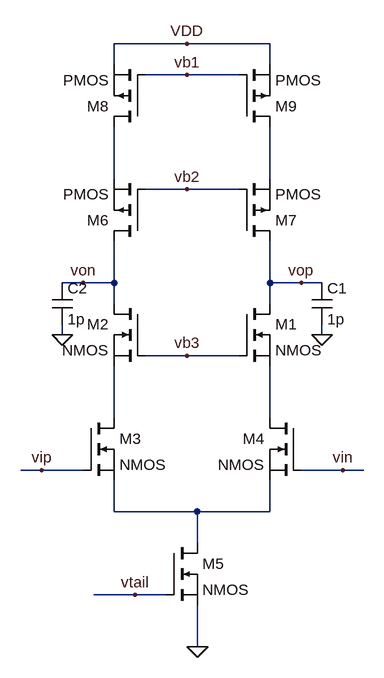
[diagram p0: schematic fully_differential_tele_casc.asc]
fully_differential_tele_casc.asc, the LTspice schematic file:
Version 4.1
SHEET 1 880 680
WIRE 0 -336 -112 -336
WIRE 128 -336 0 -336
WIRE -112 -304 -112 -336
WIRE 128 -304 128 -336
WIRE 0 -288 -64 -288
WIRE 80 -288 0 -288
WIRE -112 -128 -112 -208
WIRE 128 -128 128 -208
WIRE 0 -112 -64 -112
WIRE 80 -112 0 -112
WIRE -160 32 -192 32
WIRE -112 32 -112 -32
WIRE -112 32 -160 32
WIRE 128 32 128 -32
WIRE 176 32 128 32
WIRE 208 32 176 32
WIRE -112 64 -112 32
WIRE 128 64 128 32
WIRE -192 112 -192 96
WIRE 208 112 208 96
WIRE 0 144 -64 144
WIRE 80 144 0 144
WIRE -112 240 -112 160
WIRE 128 240 128 160
WIRE -224 320 -256 320
WIRE -160 320 -224 320
WIRE 240 320 176 320
WIRE 272 320 240 320
WIRE -112 384 -112 336
WIRE 16 384 -112 384
WIRE 128 384 128 336
WIRE 128 384 16 384
WIRE 16 432 16 384
WIRE -80 512 -144 512
WIRE -32 512 -80 512
WIRE 16 592 16 528
FLAG 0 -336 VDD
FLAG 0 144 vb3
FLAG 208 112 0
FLAG 176 32 vop
FLAG -192 112 0
FLAG -160 32 von
FLAG 16 592 0
FLAG -80 512 vtail
FLAG -224 320 vip
FLAG 240 320 vin
FLAG 0 -288 vb1
FLAG 0 -112 vb2
SYMBOL nmos 80 64 R0
SYMATTR InstName M1
SYMBOL nmos -64 64 M0
SYMATTR InstName M2
SYMBOL nmos -160 240 R0
SYMATTR InstName M3
SYMBOL nmos 176 240 M0
SYMATTR InstName M4
SYMBOL nmos -32 432 R0
SYMATTR InstName M5
SYMBOL cap 192 32 R0
SYMATTR InstName C1
SYMATTR Value 1p
SYMBOL cap -208 32 R0
SYMATTR InstName C2
SYMATTR Value 1p
SYMBOL pmos -64 -32 R180
SYMATTR InstName M6
SYMBOL pmos 80 -32 M180
SYMATTR InstName M7
SYMBOL pmos -64 -208 R180
SYMATTR InstName M8
SYMBOL pmos 80 -208 M180
SYMATTR InstName M9

The netlist it stands for:
* fully_differential_tele_casc.asc
M1 vop vb3 N004 N004 NMOS
M2 von vb3 N003 N003 NMOS
M3 N003 vip N005 N005 NMOS
M4 N004 vin N005 N005 NMOS
M5 N005 vtail 0 0 NMOS
C1 vop 0 1p
C2 von 0 1p
M6 von vb2 N001 N001 PMOS
M7 vop vb2 N002 N002 PMOS
M8 N001 vb1 VDD VDD PMOS
M9 N002 vb1 VDD VDD PMOS
.model NMOS NMOS
.model PMOS PMOS
.lib standard.mos
.backanno
.end